# Altium schematic sheet FPGA.SchDoc: FPGA top level
size A4; Author: L. Sartory; Organization: L. Sartory; Address2: Nixie clock; Address3: with GPS synchronization; DocumentNumber: 4; Revision: B1; SheetNumber: 4; SheetTotal: 12
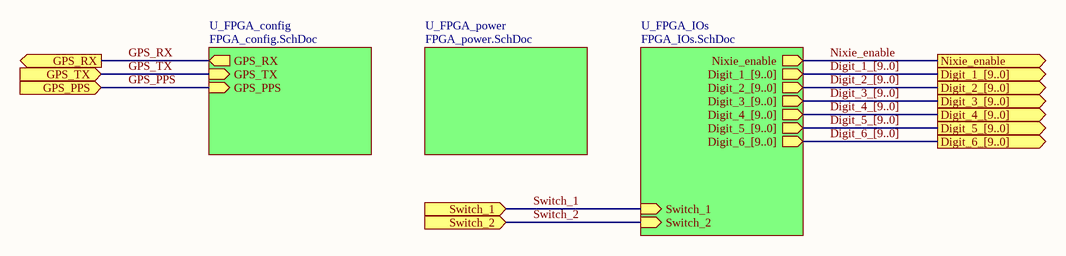
[diagram p0: FPGA.SchDoc]

## Sub-sheets
U_FPGA_config = FPGA_config.SchDoc: GPS_TX (in), GPS_RX (out), GPS_PPS (in)
U_FPGA_IOs = FPGA_IOs.SchDoc: Nixie_enable (out), Digit_1_[9..0] (out), Digit_2_[9..0] (out), Digit_3_[9..0] (out), Digit_4_[9..0] (out), Digit_5_[9..0] (out), Digit_6_[9..0] (out), Switch_2 (in), Switch_1 (in)
U_FPGA_power = FPGA_power.SchDoc: no entries

## Ports
Digit_1_[9..0] (out), Digit_2_[9..0] (out), Digit_3_[9..0] (out), Digit_4_[9..0] (out), Digit_5_[9..0] (out), Digit_6_[9..0] (out), GPS_PPS (in), GPS_RX (out), GPS_TX (in), Nixie_enable (out), Switch_1 (in), Switch_2 (in)

## Nets
GPS_PPS: port GPS_PPS, sheet U_FPGA_config/GPS_PPS
GPS_RX: port GPS_RX, sheet U_FPGA_config/GPS_RX
GPS_TX: port GPS_TX, sheet U_FPGA_config/GPS_TX
Nixie_enable: port Nixie_enable, sheet U_FPGA_IOs/Nixie_enable
Switch_1: port Switch_1, sheet U_FPGA_IOs/Switch_1
Switch_2: port Switch_2, sheet U_FPGA_IOs/Switch_2

## Buses and harness runs
bus Digit_1_[9..0] = port Digit_1_[9..0] = sheet U_FPGA_IOs/Digit_1_[9..0]
bus Digit_2_[9..0] = port Digit_2_[9..0] = sheet U_FPGA_IOs/Digit_2_[9..0]
bus Digit_3_[9..0] = port Digit_3_[9..0] = sheet U_FPGA_IOs/Digit_3_[9..0]
bus Digit_4_[9..0] = port Digit_4_[9..0] = sheet U_FPGA_IOs/Digit_4_[9..0]
bus Digit_5_[9..0] = port Digit_5_[9..0] = sheet U_FPGA_IOs/Digit_5_[9..0]
bus Digit_6_[9..0] = port Digit_6_[9..0] = sheet U_FPGA_IOs/Digit_6_[9..0]

## Notes on the sheet
- Title
- Size:
- Date:
- A4
- Number:
- Time:
- Revision:
- Sheet
- of
- File: